# EAGLE design m-power-v0 (EAGLE 5.07)
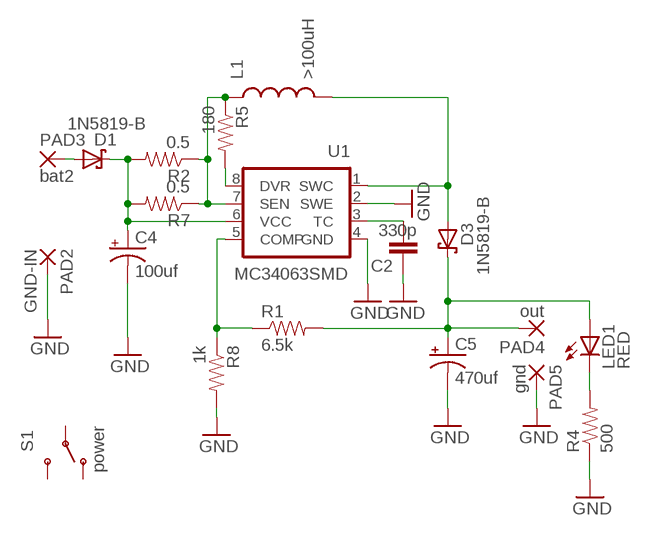
[diagram p0: schematic, sheet 1]

## Parts
C2  330p  CAP0805  [0805]
C4  100uf  CAP_POL1206  [EIA3216]
C5  470uf  CAP_POL1206  [EIA3216]
D1  1N5819-B  [DO41-7.6]
D3  1N5819-B  [DO41-7.6]
L1  >100uH  INDUCTORCR54  [CR54]
LED1  RED  LED0805  [CHIPLED_0805]
PAD2  GND-IN  3,17/1,1  [3,17/1,1]
PAD3  bat2  3,17/1,1  [3,17/1,1]
PAD4  out  3,17/1,1  [3,17/1,1]
PAD5  gnd  3,17/1,1  [3,17/1,1]
R1  6.5k  RESISTOR0805  [0805]
R2  0.5  RESISTOR0805  [0805]
R4  500  RESISTOR0805  [0805]
R5  180  RESISTOR0805  [0805]
R7  0.5  RESISTOR0805  [0805]
R8  1k  RESISTOR0805  [0805]
S1  power  SWITCH-SPST3AM6  [SWITCH-SPDT-AM#6]
U1  MC34063SMD  [SO08]

## Nets
GND: C2.1 C4.C(-) C5.C(-) PAD2.1(P) PAD5.1(P) R4.1 R8.2 U1.2(SWE) U1.4(GND)
N$1: C2.2 U1.3(TC)
N$2: C4.A(+) D1.C R2.2 R7.2 U1.6(VCC)
N$3: R1.1 R8.1 U1.5(COMP)
N$4: C5.A(+) D3.C LED1.A PAD4.1(P) R1.2
N$5: LED1.C R4.2
N$6: R5.2 U1.8(DVR)
N$8: L1.P$1 R2.1 R5.1 R7.1 U1.7(SEN)
N$9: D1.A PAD3.1(P)
N$10: D3.A L1.P$2 U1.1(SWC)
Unconnected: S1.1(O) S1.2(P) S1.3(S)

## Library data of the parts
C2 = SparkFun:CAP: Capacitor Standard 0603 ceramic capacitor, and 0.1" leaded capacitor.
C4 C5 = SparkFun:CAP_POL: Capacitor Polarized These are standard SMD and PTH capacitors. Normally 10uF, 47uF, and 100uF in electrolytic and tantalum varieties. Always verify the external diameter of the through hole cap, it varies with capacity, voltage, and manufacturer. The EIA devices should be standard.
D1 D3 = digital-toy:1N581*: 1.0A SCHOTTKY BARRIER RECTIFIER Source: http://www.diodes.com/datasheets/ds23001.pdf
L1 = SparkFun:INDUCTOR: Inductors Basic Inductor/Choke - 0603 and 1206. Footprints are not proven and vary greatly between part numbers.
LED1 = digital-toy:LED: LEDs Standard schematic elements and footprints for 5mm, 3mm, 1206, and 0603 sized LEDs. 5mm - Spark Fun Electronics SKU : COM-00529 (and others) copy led.lbr 0805 led here, by hyl digital-toy. 2010.6.29
PAD2-PAD5 = wirepad:3,17/1,1: THROUGH-HOLE PAD
R1 R2 R4 R5 R7 R8 = digital-toy:RESISTOR: Resistor Basic schematic elements and footprints for 0603, 1206, and PTH 1/10th watt (small) resistors. digital-toy copy vertical mount of axial-0.3 from rcl.lbr : the 0207/xx
S1 = digital-toy:SWITCH-SPST: SPST Switch Simple slide switch. Spark Fun Electronics SKU : COM-00102
U1 = digital-toy:MC34063: digital toy dip8-l smd

## Board
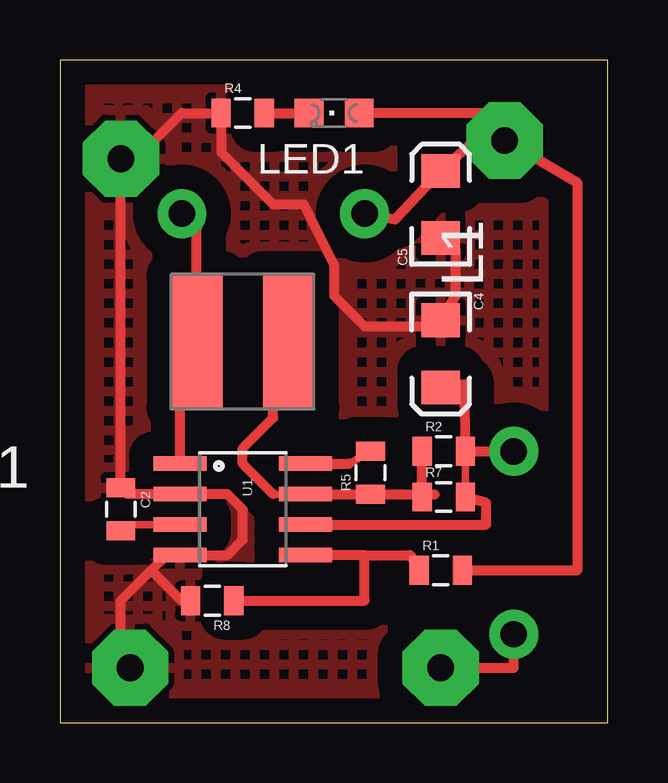
[diagram p1: board, top side]
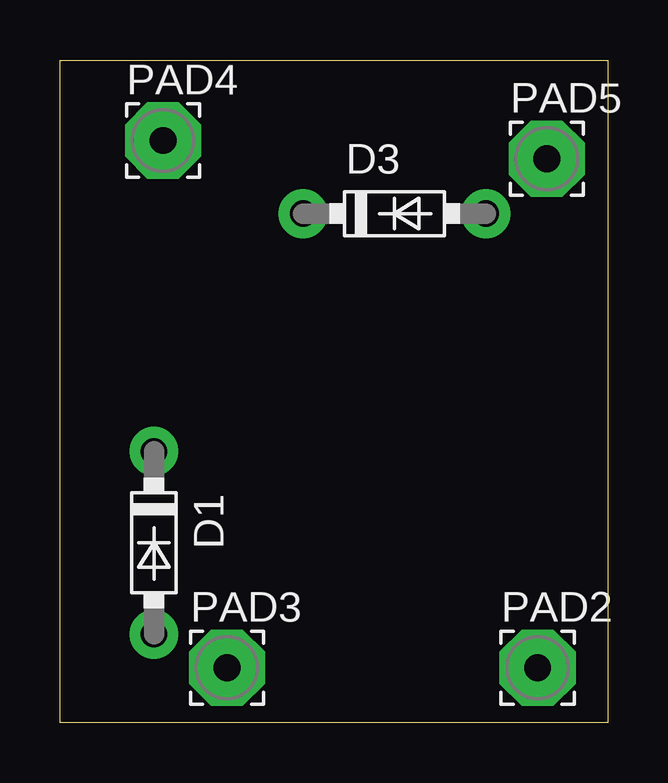
[diagram p2: board, bottom side, seen from below]

Size 22.84 x 27.61 mm. Coordinates in mm from the lower left corner, seen from the top.
Outline: 0,0 22.84,0 22.84,27.61 0,27.61 0,0
Copper layers (1*16): Top 0.035mm / dielectric 1.5mm / Bottom 0.035mm
Design rules "SparkFun": minimum track width 8mil, minimum drill 20mil, track to track 8mil, track to pad 8mil, pad to pad 8mil, via to via 8mil, smd to smd 8mil, copper to edge 10mil, drill to drill 8mil, minimum pad ring 12mil, minimum via ring 10mil, stop-mask expansion 4mil, vias tented up to drill 25mil, thermal gap 10mil

### Footprints (pad centres in the part's own frame; a part is rotated, then mirrored left to right if it is on the bottom)
0805 = smd 0.8 x 1.2: 1 -0.9,0; 2 0.9,0
EIA3216 = smd 1.4 x 1.6: A 1.4,0; C -1.4,0
DO41-7.6 = drill 1.1 pad 2.032 round: A 3.81,0; C -3.81,0
CR54 = smd 5.5 x 2.15: P$1 0,1.92; P$2 0,-1.92
CHIPLED_0805 = smd 1.2 x 1.2: A 0,-1.05; C 0,1.05
3,17/1,1 = drill 1.118 pad 3.175 octagon: 1 0,0
SWITCH-SPDT-AM#6 = drill 0.762 pad 1.27 long: 1 0,2; 2 0,0; 3 0,-2 | drill 1.15 pad 2.184 square: P$1 0,-4.445; P$2 0,4.445
SO08 = smd 0.61 x 2.21: 1 -1.905,-2.616; 2 -0.635,-2.616; 3 0.635,-2.616; 4 1.905,-2.616; 5 1.905,2.616; 6 0.635,2.616; 7 -0.635,2.616; 8 -1.905,2.616

### Placement (x,y rotation side)
C2  2.54,8.89 270 top
C4  15.88,15.37 270 top
C5  15.88,21.59 90 top
D1  18.92,7.49 270 bottom
D3  8.89,21.21 0 bottom
L1  7.62,15.88 270 top
LED1  11.43,25.4 90 top
PAD2  2.92,2.29 0 bottom
PAD3  15.88,2.29 0 bottom
PAD4  18.54,24.26 0 bottom
PAD5  2.54,23.5 0 bottom
R1  15.88,6.35 0 top
R2  16,11.3 0 top
R4  7.62,25.4 0 top
R5  12.95,10.41 90 top
R7  16,9.4 0 top
R8  6.35,5.08 180 top
S1  -5.08,19.18 180 top  (outside the outline)
U1  7.62,8.89 270 top

### Tracks (layer width: path | path; a pad name or v marks a point on that pad's centre or on a via)
GND
  Top 0.305: 2.81,9.53 C2.1
  Top 0.406: 2.81,9.53 U1.2 6.99,9.53 7.62,8.89 7.62,7.62 6.99,6.99 U1.4 4.45,6.99 3.81,6.35 | PAD2.1 2.79,2.29 2.54,2.54 2.54,5.08 3.81,6.35 | R8.2 5.08,5.08 3.81,6.35 | C2.1 PAD5.1 3.17,23.5 5.08,25.4 R4.1 6.72,23.76 8.89,21.59 10.16,21.59 11.43,19.05 11.43,17.78 12.7,16.51 15.24,16.51 C4.C 16.51,17.78 16.51,19.68 C5.C
  pour Top (isolate 1.016, hatched): -1.91,30.48 26.67,31.11 26.04,2.54 24.77,-2.54 0,-2.54 -3.17,-0.64 -3.17,26.04
N$1
  Top 0.305: U1.3 2.81,8.26 C2.2
N$2
  Top 0.305: R7.2 R2.2
  Top 0.406: U1.6 17.78,8.26 17.78,9.15 R7.2 | D1.C R2.2 16.89,14.1 C4.A
N$3
  Top 0.406: R8.1 12.7,5.08 12.7,6.99 | 12.7,6.99 U1.5 | 12.7,6.99 14.61,6.99 R1.1
N$4
  Top 0.406: PAD4.1 21.59,22.48 21.59,6.35 R1.2 | D3.C 13.97,20.95 C5.A 17.27,24.26 PAD4.1 | LED1.A 17.78,25.4 17.78,25.02 PAD4.1
N$5
  Top 0.406: R4.2 LED1.C
N$6
  Top 0.305: 12.06,10.79 R5.2
  Top 0.406: U1.8 12.06,10.79
N$8
  Top 0.305: 12.94,9.53 R5.1 | 8.89,9.53 U1.7 | 8.89,15.22 L1.P$1
  Top 0.406: U1.7 12.94,9.53 | R5.1 15.62,9.51 R7.1 R2.1 | 8.89,9.53 7.62,10.79 7.62,11.43 8.89,12.7 8.89,15.22
N$9
  Top 0.406: PAD3.1 18.92,2.29 D1.A
N$10
  Top 0.406: U1.1 5,15.18 L1.P$2 5.7,20.59 D3.A